# EAGLE design openinstrument (EAGLE 6.5.0)
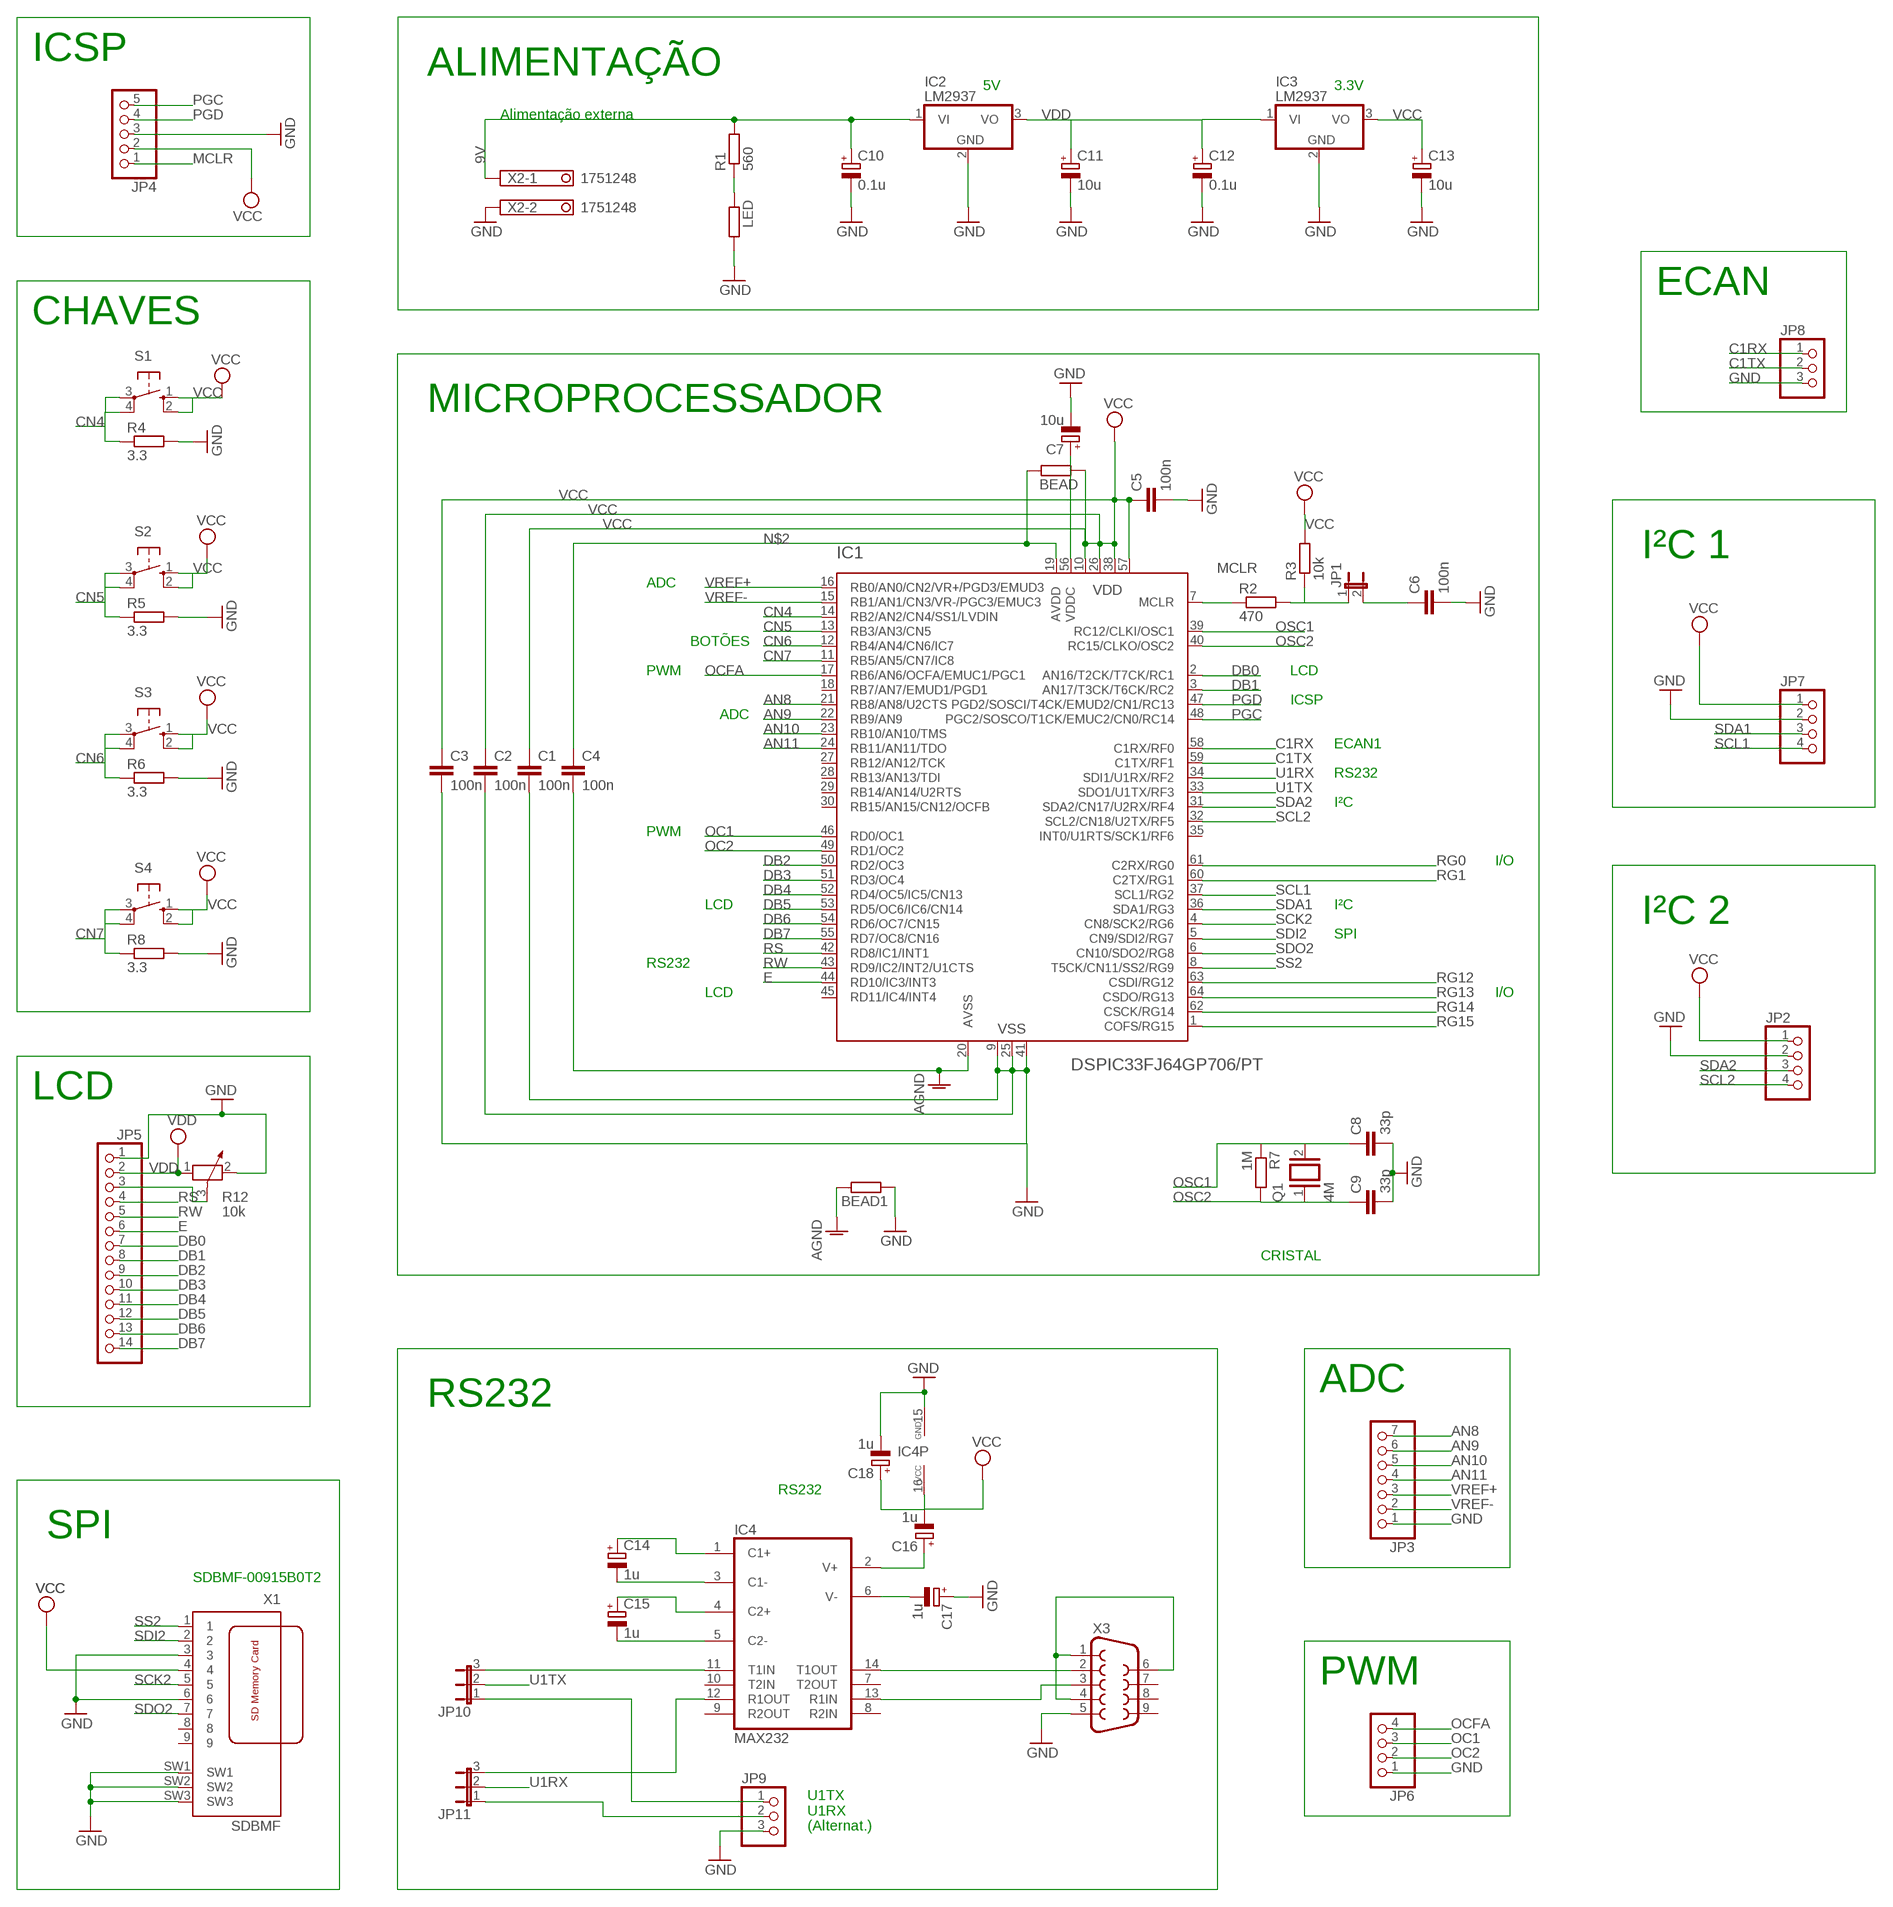
[diagram p0: schematic, sheet 1]

## Parts
BEAD  R-EU_R0805  [R0805]
BEAD1  R-EU_R0805  [R0805]
C1  100n  C-EUC0805  [C0805]
C2  100n  C-EUC0805  [C0805]
C3  100n  C-EUC0805  [C0805]
C4  100n  C-EUC0805  [C0805]
C5  100n  C-EUC0805  [C0805]
C6  100n  C-EUC0805  [C0805]
C7  10u  CPOL-EUE2.5-5  [E2,5-5]
C8  33p  C-EUC0805  [C0805]
C9  33p  C-EUC0805  [C0805]
C10  0.1u  CPOL-EUE2.5-5  [E2,5-5]
C11  10u  CPOL-EUE2.5-5  [E2,5-5]
C12  0.1u  CPOL-EUE2.5-5  [E2,5-5]
C13  10u  CPOL-EUE2.5-5  [E2,5-5]
C14  1u  CPOL-EUE2.5-5  [E2,5-5]
C15  1u  CPOL-EUE2.5-5  [E2,5-5]
C16  1u  CPOL-EUE2.5-5  [E2,5-5]
C17  1u  CPOL-EUE2.5-5  [E2,5-5]
C18  1u  CPOL-EUE2.5-5  [E2,5-5]
IC1  DSPIC33FJ64GP706/PT  [TQFP64-10X10]
IC2  LM2937  [TO263-3]
IC3  LM2937  [TO263-3]
IC4  MAX232  [DIL16]
JP1  JP1E  [JP1]
JP2  PINHD-1X4  [1X04]
JP3  PINHD-1X7  [1X07]
JP4  PINHD-1X5  [1X05]
JP5  PINHD-1X14  [1X14]
JP6  PINHD-1X4  [1X04]
JP7  PINHD-1X4  [1X04]
JP8  PINHD-1X3  [1X03]
JP9  PINHD-1X3  [1X03]
JP10  JP2E  [JP2]
JP11  JP2E  [JP2]
LED  R-EU_R0805  [R0805]
Q1  4M  XTAL/S  [QS]
R1  560  R-EU_R0805  [R0805]
R2  470  R-EU_R0805  [R0805]
R3  10k  R-EU_R0805  [R0805]
R4  3.3  R-EU_R0805  [R0805]
R5  3.3  R-EU_R0805  [R0805]
R6  3.3  R-EU_R0805  [R0805]
R7  1M  R-EU_R0805  [R0805]
R8  3.3  R-EU_R0805  [R0805]
R12  10k  POTENTIOMETER_PT-10S  [PT-10S]
S1  10-XX  [B3F-10XX]
S2  10-XX  [B3F-10XX]
S3  10-XX  [B3F-10XX]
S4  10-XX  [B3F-10XX]
X1  SDBMF  [SDBMF-009XXBXX2]
X2  1751248  [1751248]
X3  F09H  [F09H]

## Nets
9V: C10.+ IC2.1(VI) R1.2 X2.1
AGND: BEAD1.2 C4.2 IC1.20(AVSS)
AN8: IC1.21(RB8/AN8/U2CTS) JP3.7
AN9: IC1.22(RB9/AN9) JP3.6
AN10: IC1.23(RB10/AN10/TMS) JP3.5
AN11: IC1.24(RB11/AN11/TDO) JP3.4
C1RX: IC1.58(C1RX/RF0) JP8.1
C1TX: IC1.59(C1TX/RF1) JP8.2
CN4: IC1.14(RB2/AN2/CN4/SS1/LVDIN) R4.1 S1.3(P) S1.4(P1)
CN5: IC1.13(RB3/AN3/CN5) R5.1 S2.3(P) S2.4(P1)
CN6: IC1.12(RB4/AN4/CN6/IC7) R6.1 S3.3(P) S3.4(P1)
CN7: IC1.11(RB5/AN5/CN7/IC8) R8.1 S4.3(P) S4.4(P1)
DB0: IC1.2(AN16/T2CK/T7CK/RC1) JP5.7
DB1: IC1.3(AN17/T3CK/T6CK/RC2) JP5.8
DB2: IC1.50(RD2/OC3) JP5.9
DB3: IC1.51(RD3/OC4) JP5.10
DB4: IC1.52(RD4/OC5/IC5/CN13) JP5.11
DB5: IC1.53(RD5/OC6/IC6/CN14) JP5.12
DB6: IC1.54(RD6/OC7/CN15) JP5.13
DB7: IC1.55(RD7/OC8/CN16) JP5.14
E: IC1.44(RD10/IC3/INT3) JP5.6
GND: BEAD1.1 C1.2 C2.2 C3.2 C5.2 C6.2 C7.- C8.2 C9.2 C10.- C11.- C12.- C13.- C17.+ C18.- IC1.9(VSS) IC1.25(VSS) IC1.41(VSS) IC2.2(GND) IC3.2(GND) IC4.15(GND) JP2.2 JP3.1 JP4.3 JP5.1 JP6.1 JP7.2 JP8.3 JP9.3 LED.2 R4.2 R5.2 R6.2 R8.2 R12.2 X1.3 X1.6 X1.SW1 X1.SW2 X1.SW3 X2.2 X3.5
MCLR: JP4.1 R2.1
N$1: JP5.3 R12.3
N$2: BEAD.2 C4.1 IC1.19(AVDD)
N$3: JP1.1 R2.2 R3.1
N$4: C6.1 JP1.2
N$6: IC4.14(T1OUT) X3.2
N$7: C14.- IC4.3(C1-)
N$8: C14.+ IC4.1(C1+)
N$9: C15.- IC4.5(C2-)
N$10: C7.+ IC1.56(VDDC)
N$11: LED.1 R1.1
N$12: C15.+ IC4.4(C2+)
N$13: C16.+ IC4.2(V+)
N$14: C17.- IC4.6(V-)
N$15: IC4.13(R1IN) X3.3
N$16: X3.1 X3.4 X3.6
N$17: IC4.12(R1OUT) JP11.3
N$18: JP9.1 JP10.1
N$19: IC4.11(T1IN) JP10.3
N$21: JP9.2 JP11.1
OC1: IC1.46(RD0/OC1) JP6.3
OC2: IC1.49(RD1/OC2) JP6.2
OCFA: IC1.17(RB6/AN6/OCFA/EMUC1/PGC1) JP6.4
OSC1: C8.1 IC1.39(RC12/CLKI/OSC1) Q1.2 R7.1
OSC2: C9.1 IC1.40(RC15/CLKO/OSC2) Q1.1 R7.2
PGC: IC1.48(PGC2/SOSCO/T1CK/EMUC2/CN0/RC14) JP4.5
PGD: IC1.47(PGD2/SOSCI/T4CK/EMUD2/CN1/RC13) JP4.4
RG0: IC1.61(C2RX/RG0)
RG1: IC1.60(C2TX/RG1)
RG12: IC1.63(CSDI/RG12)
RG13: IC1.64(CSDO/RG13)
RG14: IC1.62(CSCK/RG14)
RG15: IC1.1(COFS/RG15)
RS: IC1.42(RD8/IC1/INT1) JP5.4
RW: IC1.43(RD9/IC2/INT2/U1CTS) JP5.5
SCK2: IC1.4(CN8/SCK2/RG6) X1.5
SCL1: IC1.37(SCL1/RG2) JP7.4
SCL2: IC1.32(SCL2/CN18/U2TX/RF5) JP2.4
SDA1: IC1.36(SDA1/RG3) JP7.3
SDA2: IC1.31(SDA2/CN17/U2RX/RF4) JP2.3
SDI2: IC1.5(CN9/SDI2/RG7) X1.2
SDO2: IC1.6(CN10/SDO2/RG8) X1.7
SS2: IC1.8(T5CK/CN11/SS2/RG9) X1.1
U1RX: IC1.34(SDI1/U1RX/RF2) JP11.2
U1TX: IC1.33(SDO1/U1TX/RF3) JP10.2
VCC: BEAD.1 C1.1 C2.1 C3.1 C5.1 C13.+ C16.- C18.+ IC1.10(VDD) IC1.26(VDD) IC1.38(VDD) IC1.57(VDD) IC3.3(VO) IC4.16(VCC) JP2.1 JP4.2 JP7.1 R3.2 S1.1(S) S1.2(S1) S2.1(S) S2.2(S1) S3.1(S) S3.2(S1) S4.1(S) S4.2(S1) X1.4
VDD: C11.+ C12.+ IC2.3(VO) IC3.1(VI) JP5.2 R12.1
VREF+: IC1.16(RB0/AN0/CN2/VR+/PGD3/EMUD3) JP3.3
VREF-: IC1.15(RB1/AN1/CN3/VR-/PGC3/EMUC3) JP3.2
Unconnected: IC1.7(MCLR) IC1.18(RB7/AN7/EMUD1/PGD1) IC1.27(RB12/AN12/TCK) IC1.28(RB13/AN13/TDI) IC1.29(RB14/AN14/U2RTS) IC1.30(RB15/AN15/CN12/OCFB) IC1.35(INT0/U1RTS/SCK1/RF6) IC1.45(RD11/IC4/INT4) IC4.7(T2OUT) IC4.8(R2IN) IC4.9(R2OUT) IC4.10(T2IN) X1.8 X1.9 X3.7 X3.8 X3.9

## Notes on the sheet
- ICSP
- ALIMENTAÇÃO
- 5V | 3.3V
- Alimentação externa
- ECAN
- CHAVES
- MICROPROCESSADOR
- I²C 1
- ADC
- BOTÕES
- PWM | LCD
- ICSP
- ADC
- ECAN1
- RS232
- I²C
- PWM
- I/O
- LCD | I²C
- I²C 2
- SPI
- RS232
- LCD | I/O
- LCD
- CRISTAL
- RS232
- ADC
- RS232
- SPI
- SDBMF-00915B0T2
- PWM
- U1TX
  U1RX
  (Alternat.)

## Library data of the parts
BEAD BEAD1 LED R1-R8 = rcl:R-EU_: RESISTOR, European symbol
C1-C6 C8 C9 = rcl:C-EU: CAPACITOR, European symbol
C7 C10-C18 = rcl:CPOL-EU: POLARIZED CAPACITOR, European symbol
IC1 = microchip-dspic:DSPIC33FJ64GP706: dsPIC33 General DSC with CAN and CoDec ports
IC2 IC3 = linear:LM2937: LM2937-2.5, LM2937-3.3 400mA and 500mA Voltage Regulators Source: http://cache.national.com/ds/LM/LM2937-2.5.pdf
IC4 = maxim:MAX232: RS232 TRANSCEIVER; MF: MAXIM; MPN: MAX232ACPE+; OC_FARNELL: 9723773; OC_NEWARK: 68K4544
JP1 = jumper:JP1E: JUMPER
JP2 JP6 JP7 = pinhead:PINHD-1X4: PIN HEADER
JP3 = pinhead:PINHD-1X7: PIN HEADER
JP4 = pinhead:PINHD-1X5: PIN HEADER
JP5 = pinhead:PINHD-1X14: PIN HEADER
JP8 JP9 = pinhead:PINHD-1X3: PIN HEADER
JP10 JP11 = jumper:JP2E: JUMPER
Q1 = special:XTAL/S: CRYSTAL
R12 = rcl:POTENTIOMETER_: Potentiometer
S1-S4 = switch-omron:10-XX: OMRON SWITCH; MPN: B3F-1000; OC_FARNELL: 176432; OC_NEWARK: 36M3542
X1 = farnell:SDBMF: SD MEMORY CARD PUSH-PUSH WITH CONNECTOR TYPE B (BIG SWUÌTCH #3) KINGFONT PRECISION INDUSTIAL CO., LTD Source: http://www.farnell.com/datasheets/74273.pdf Best.-Nr.: 9186174 Hersteller: MULTICOMP Herstellerbez.: SDBMF-00915B0T2
X2 = con-phoenix-350:1751248: MKDS 1/ 2-3,5 Printklemme Nennstrom: 10 A Bemessungsspannung: 160 V Raster: 3,5 mm Polzahl: 2 Montageart: Löten Anschlussart: Schraubanschluss Anschlussrichtung vom Leiter zur Platine: 0° Source: http://eshop.phoenixcontact.com .. 1751248.pdf; OC_FARNELL: unknown; OC_NEWARK: unknown
X3 = con-subd:F09: SUB-D; OC_FARNELL: unknown; OC_NEWARK: unknown

## Board
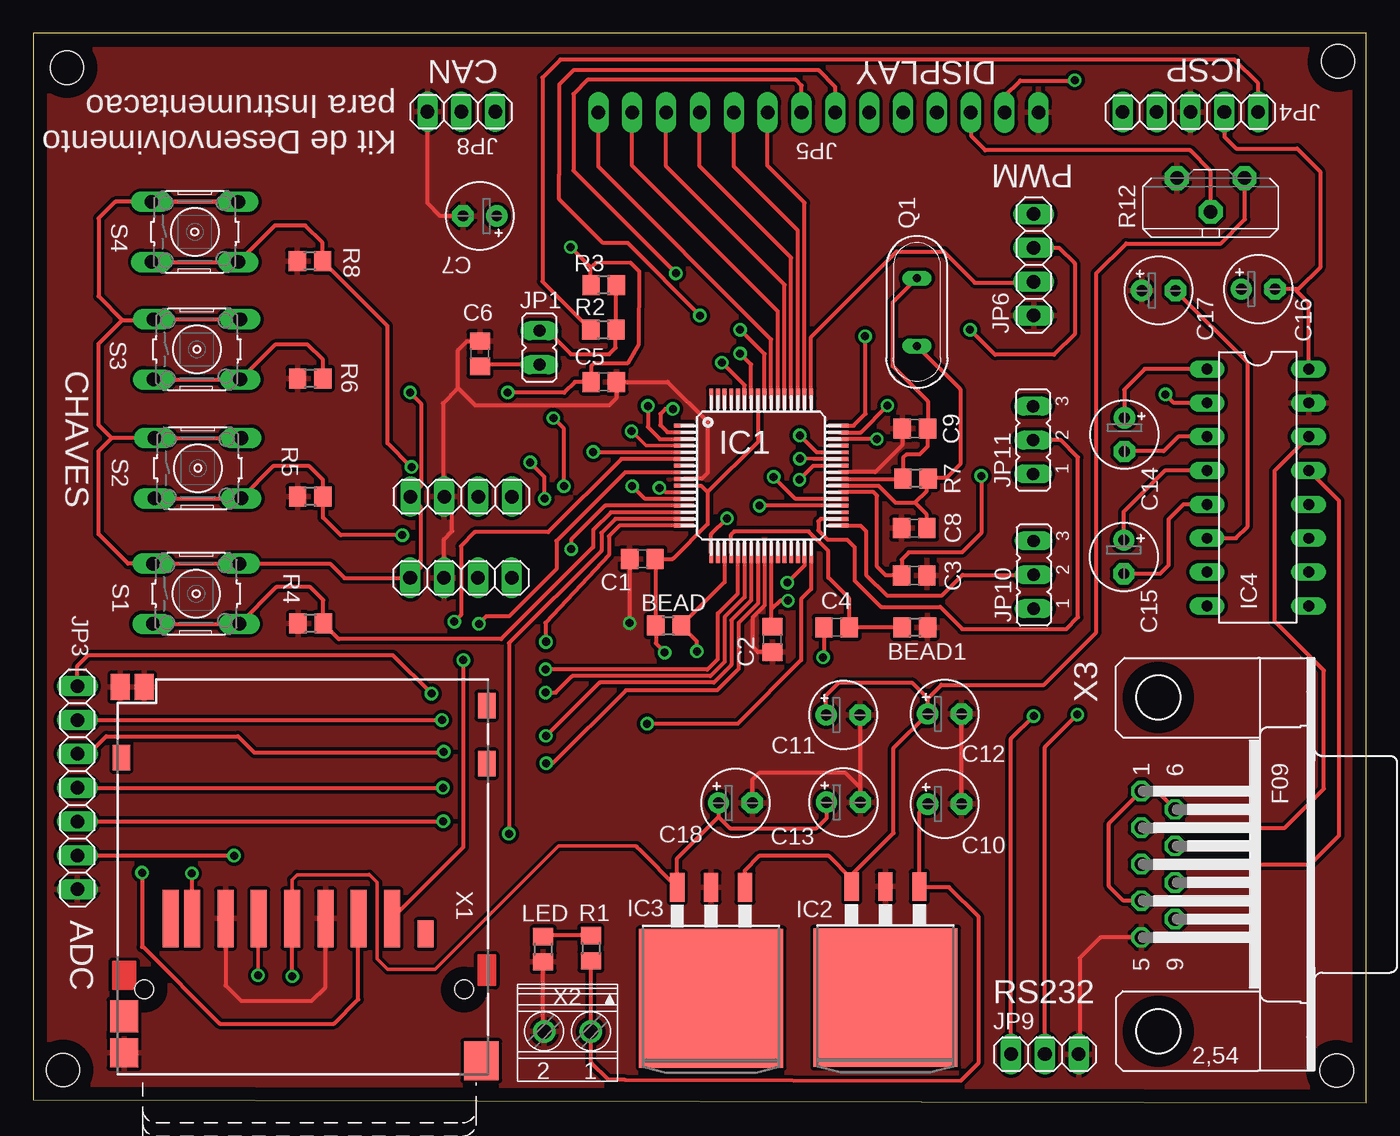
[diagram p1: board, top side]
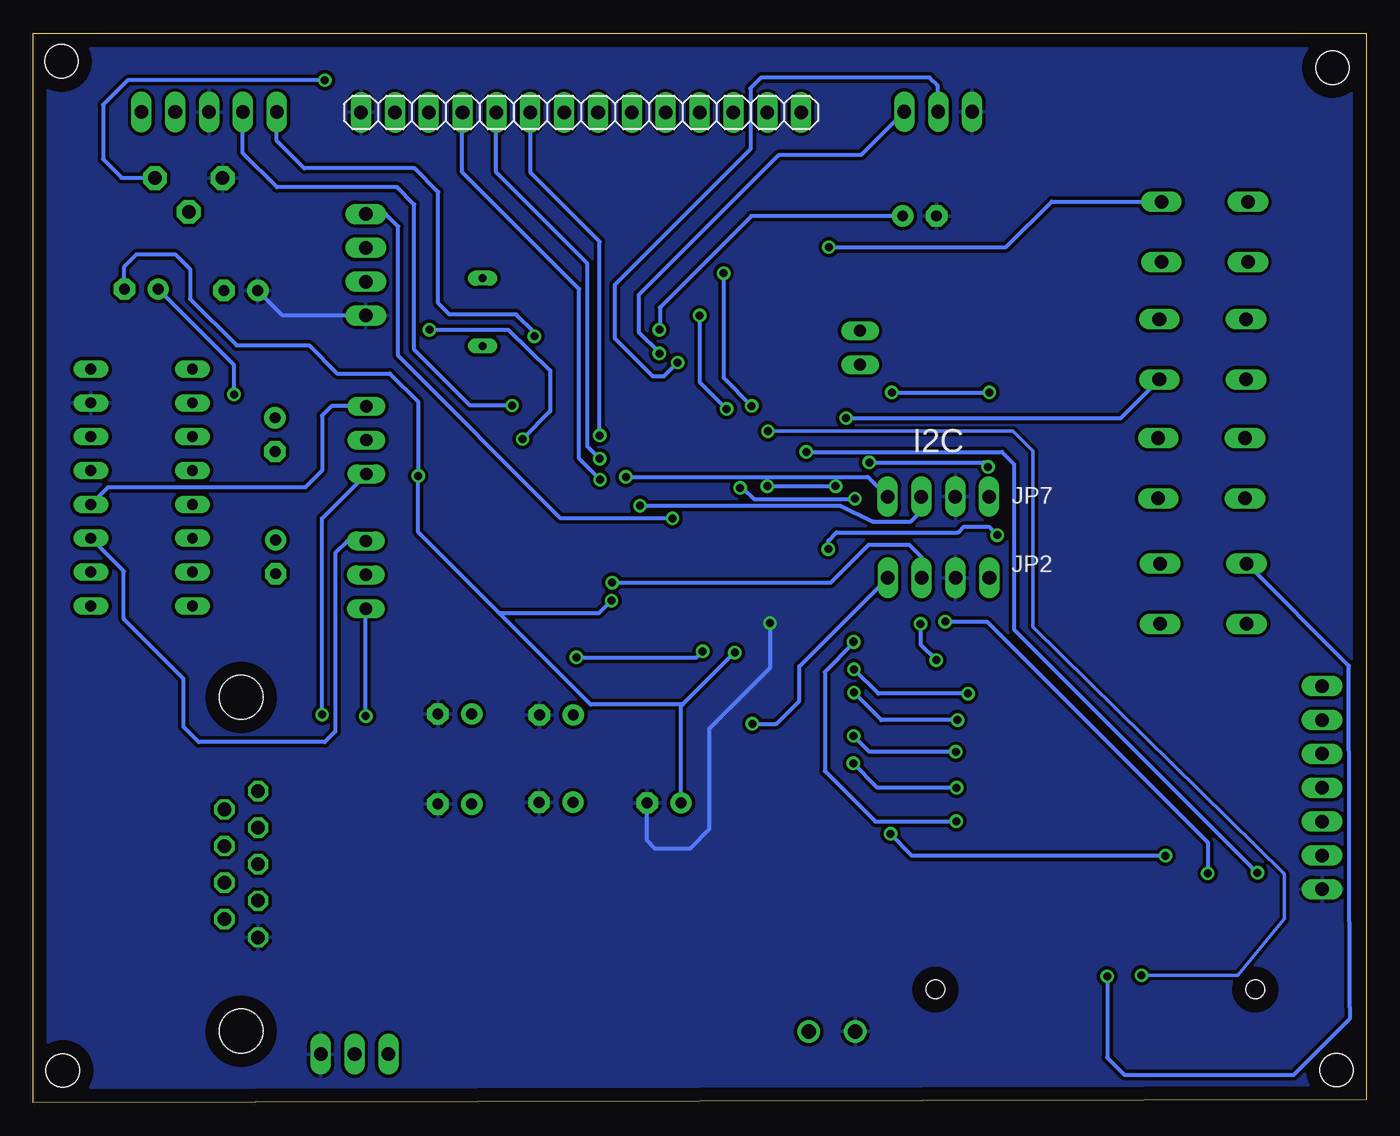
[diagram p2: board, bottom side, seen from below]

Size 100 x 80.23 mm. Coordinates in mm from the lower left corner, seen from the top.
Outline: 0,0.23 100,0 100,80.23 0,80.23 0,0.23
Copper layers (1*16): Top 0.035mm / dielectric 1.5mm / Bottom 0.035mm
Design rules "default *": minimum track width 10mil, minimum drill 24mil, track to track 10mil, track to pad 10mil, pad to pad 10mil, via to via 10mil, smd to smd 10mil, copper to edge 40mil, drill to drill 8mil, minimum pad ring 10mil, minimum via ring 8mil, stop-mask expansion 4mil, vias tented up to drill 0mil, thermal gap 10mil
Holes 2.5 mm at 2.51,77.65 97.89,78.13 97.79,2.41 2.24,2.44

### Footprints (pad centres in the part's own frame; a part is rotated, then mirrored left to right if it is on the bottom)
R0805 = smd 1.3 x 1.5: 1 -0.95,0; 2 0.95,0
C0805 = smd 1.3 x 1.5: 1 -0.95,0; 2 0.95,0
E2,5-5 = drill 0.813 pad 1.6: + -1.27,0 | drill 0.813 pad 1.6 octagon: - 1.27,0
TQFP64-10X10 = smd 1.5 x 0.28: 1 -5.8,3.75; 2 -5.8,3.25; 3 -5.8,2.75; 4 -5.8,2.25; 5 -5.8,1.75; 6 -5.8,1.25; 7 -5.8,0.75; 8 -5.8,0.25; 9 -5.8,-0.25; 10 -5.8,-0.75; 11 -5.8,-1.25; 12 -5.8,-1.75; 13 -5.8,-2.25; 14 -5.8,-2.75; 15 -5.8,-3.25; 16 -5.8,-3.75; 33 5.8,-3.75; 34 5.8,-3.25; 35 5.8,-2.75; 36 5.8,-2.25; 37 5.8,-1.75; 38 5.8,-1.25; 39 5.8,-0.75; 40 5.8,-0.25; 41 5.8,0.25; 42 5.8,0.75; 43 5.8,1.25; 44 5.8,1.75; 45 5.8,2.25; 46 5.8,2.75; 47 5.8,3.25; 48 5.8,3.75 | smd 0.28 x 1.5: 17 -3.75,-5.8; 18 -3.25,-5.8; 19 -2.75,-5.8; 20 -2.25,-5.8; 21 -1.75,-5.8; 22 -1.25,-5.8; 23 -0.75,-5.8; 24 -0.25,-5.8; 25 0.25,-5.8; 26 0.75,-5.8; 27 1.25,-5.8; 28 1.75,-5.8; 29 2.25,-5.8; 30 2.75,-5.8; 31 3.25,-5.8; 32 3.75,-5.8; 49 3.75,5.8; 50 3.25,5.8; 51 2.75,5.8; 52 2.25,5.8; 53 1.75,5.8; 54 1.25,5.8; 55 0.75,5.8; 56 0.25,5.8; 57 -0.25,5.8; 58 -0.75,5.8; 59 -1.25,5.8; 60 -1.75,5.8; 61 -2.25,5.8; 62 -2.75,5.8; 63 -3.25,5.8; 64 -3.75,5.8
TO263-3 = smd 1.067 x 2.159: 1 -2.54,-5.791; 2 0,-5.791; 3 2.54,-5.791 | smd 10.8 x 10.41: TAB 0,2.54
DIL16 = drill 0.813 long: 1 -8.89,-3.81; 2 -6.35,-3.81; 3 -3.81,-3.81; 4 -1.27,-3.81; 5 1.27,-3.81; 6 3.81,-3.81; 7 6.35,-3.81; 8 8.89,-3.81; 9 8.89,3.81; 10 6.35,3.81; 11 3.81,3.81; 12 1.27,3.81; 13 -1.27,3.81; 14 -3.81,3.81; 15 -6.35,3.81; 16 -8.89,3.81
JP1 = drill 0.914 long: 1 0,-1.27; 2 0,1.27
1X04 = drill 1.016 long: 1 -3.81,0; 2 -1.27,0; 3 1.27,0; 4 3.81,0
1X07 = drill 1.016 long: 1 -7.62,0; 2 -5.08,0; 3 -2.54,0; 4 0,0; 5 2.54,0; 6 5.08,0; 7 7.62,0
1X05 = drill 1.016 long: 1 -5.08,0; 2 -2.54,0; 3 0,0; 4 2.54,0; 5 5.08,0
1X14 = drill 1.016 long: 1 -16.51,0; 2 -13.97,0; 3 -11.43,0; 4 -8.89,0; 5 -6.35,0; 6 -3.81,0; 7 -1.27,0; 8 1.27,0; 9 3.81,0; 10 6.35,0; 11 8.89,0; 12 11.43,0; 13 13.97,0; 14 16.51,0
1X03 = drill 1.016 long: 1 -2.54,0; 2 0,0; 3 2.54,0
JP2 = drill 0.914 long: 1 -2.54,0; 2 0,0; 3 2.54,0
QS = drill 0.61 long: 1 -2.54,0; 2 2.54,0
PT-10S = drill 1.016 pad 1.778 octagon: 1 -2.54,-1.27; 2 2.54,-1.27; 3 0,1.27
B3F-10XX = drill 1.016 long: 1 -3.251,2.261; 2 3.251,2.261; 3 -3.251,-2.261; 4 3.251,-2.261
SDBMF-009XXBXX2 = smd 1.2 x 4.3: 1 6.7,5.325; 2 4.2,5.325; 3 1.7,5.325; 4 -0.8,5.325; 5 -3.3,5.325; 6 -5.8,5.325; 7 -8.3,5.325; 8 -9.925,5.325 | smd 1.2 x 2: 9 9.2,4.175 | smd 2.1 x 2.4: M1 -13.4,-2 | smd 2.6 x 2.9: M2 13.4,-5.35 | smd 1.3 x 1.9: M3 -13.6,17.4; M4 13.8,16.95; M5 13.8,21.3 | smd 1.4 x 1.95: SW1 -11.9,22.7; SW3 -13.7,22.7 | smd 2.1 x 2.2: SW2 -13.4,-4.75 | hole 1.4: -11.9,0; 12.1,0
1751248 = drill 1.1 pad 1.7: 1 -1.75,-0.1; 2 1.75,-0.1
F09H = drill 1.016 octagon: 1 -5.486,-1.27; 2 -2.743,-1.27; 3 0,-1.27; 4 2.743,-1.27; 5 5.486,-1.27; 6 -4.115,1.27; 7 -1.372,1.27; 8 1.372,1.27; 9 4.115,1.27 | hole 3.302: -12.522,0; 12.522,0

### Placement (x,y rotation side)
BEAD  47.65,35.79 0 top
BEAD1  66.14,35.66 180 top
C1  45.69,40.79 180 top
C2  55.45,34.75 270 top
C3  66.09,39.55 0 top
C4  60.27,35.66 0 top
C5  42.8,54.08 0 top
C6  33.5,56.18 90 top
C7  33.5,66.52 180 top
C8  66.09,43.1 180 top
C9  66.14,50.57 180 top
C10  68.38,22.4 0 top
C11  60.76,29.08 0 top
C12  68.38,29.16 0 top
C13  60.78,22.53 0 top
C14  81.86,50.11 270 top
C15  81.81,40.94 270 top
C16  91.9,61.04 0 top
C17  84.43,60.93 0 top
C18  52.68,22.48 0 top
IC1  54.61,47.04 0 top
IC2  63.93,10.41 180 top
IC3  50.85,10.36 180 top
IC4  91.87,46.15 270 top
JP1  37.97,56.64 180 top
JP2  32.08,39.37 0 top
JP3  3.3,23.62 90 top
JP4  86.82,74.32 180 top
JP5  58.9,74.3 0 bottom
JP6  75.06,62.87 90 top
JP7  32.11,45.47 0 top
JP8  32.11,74.35 180 top
JP9  75.9,3.63 0 top
JP10  75.06,39.6 90 top
JP11  75.01,49.71 90 top
LED  38.25,11.51 270 top
Q1  66.29,59.31 270 top
R1  41.83,11.58 270 top
R2  42.77,57.99 0 top
R3  42.8,61.34 180 top
R4  20.8,35.94 180 top
R5  20.78,45.47 180 top
R6  20.78,54.33 180 top
R7  66.19,46.84 180 top
R8  20.75,63.14 180 top
R12  88.34,68.1 180 top
S1  12.22,38.18 0 top
S2  12.34,47.6 0 top
S3  12.27,56.52 0 top
S4  12.12,65.33 0 top
X1  20.22,8.48 0 top
X2  40.08,5.23 180 top
X3  84.4,17.88 270 top

### Tracks (layer width: path | path; a pad name or v marks a point on that pad's centre or on a via)
9V
  Top 0.305: C10.+ 66.47,21.77 IC2.1 66.52,16.15 68.71,16.15 70.94,13.92 70.94,3 69.6,1.65 44.4,1.7 43.16,1.7 41.86,3 41.83,3 X2.1 R1.2
AGND
  Top 0.305: BEAD1.2 C4.2 61.22,37.81 59.64,39.4 59.64,41.38 58.17,42.85 52.6,42.85 52.36,42.61 IC1.20
AN8  (via drill 0.6)
  Top 0.305: IC1.21 52.86,38.2 51.36,36.7 51.36,33.27 50.57,32.49 38.46,32.49 v38.43,32.51 | JP3.7 3.3,32.77 4.12,33.58 26.98,33.58 v29.87,30.68
  Bottom 0.305: v29.87,30.68 36.6,30.68 v38.43,32.51
AN9  (via drill 0.6)
  Top 0.305: IC1.22 53.36,37.92 51.87,36.42 51.87,33.07 50.8,32 40.44,32 39.19,30.76 v38.43,30.76 | JP3.6 v30.66,28.7
  Bottom 0.305: v30.66,28.7 36.37,28.7 v38.43,30.76
AN10  (via drill 0.6)
  Top 0.305: IC1.23 53.86,37.68 52.38,36.19 52.38,32.84 51.05,31.52 42.49,31.52 40.31,29.36 v38.46,27.51 | JP3.5 4.17,26.16 5.49,27.48 15.37,27.48 16.59,26.26 30.73,26.26 v30.79,26.31
  Bottom 0.305: v38.46,27.51 37.26,26.31 37.08,26.31 v30.79,26.31
AN11  (via drill 0.6)
  Top 0.305: IC1.24 54.36,37.44 52.91,35.99 52.91,32.54 51.31,30.94 44.45,30.94 38.96,25.45 v38.48,25.45 | JP3.4 v30.73,23.62
  Bottom 0.305: v30.73,23.62 36.65,23.62 v38.48,25.45
C1RX  (via drill 0.6)
  Top 0.305: IC1.58 53.86,55.39 v53.03,56.21
  Bottom 0.305: v53.03,56.21 53.03,56.26 54.56,57.78 54.56,60.6 44.04,71.12 37.87,71.12 JP8.1
C1TX  (via drill 0.6)
  Top 0.305: IC1.59 53.36,53.83 v51.66,55.52
  Bottom 0.305: v51.66,55.52 52.7,54.48 53.52,54.48 56.36,57.33 56.36,61.37 46.22,71.51 46.2,71.53 46.2,76.1 45.39,76.91 32.77,76.91 32.18,76.33 32.18,74.42 JP8.2
CN4
  Top 0.305: S1.3 S1.4 18.24,38.68 20.78,38.68 21.75,37.71 R4.1 22.92,34.77 35.1,34.77 42.01,41.68 42.01,42.98 43.33,44.29 IC1.14
CN5  (via drill 0.6)
  Top 0.305: S2.3 S2.4 18.01,47.75 20.7,47.75 21.73,46.73 R5.1 21.74,45.45 21.74,43.89 23.06,42.57 v27.69,42.57 | IC1.13 42.91,44.79 40.36,42.24 v40.36,41.53
  Bottom 0.305: v40.36,41.53 40.36,42.14 39.73,42.77 30.61,42.77 30.18,43.21 28.32,43.21 v27.69,42.57
CN6  (via drill 0.6)
  Top 0.305: S3.3 S3.4 18.14,56.87 20.6,56.87 21.73,55.74 R6.1 | IC1.12 45.9,45.29 v44.93,46.25 | v39.8,46.25 39.8,50.57 v39.01,51.36
  Bottom 0.305: v44.93,46.25 v39.8,46.25 | v39.01,51.36 18.41,51.36 S3.4
CN7  (via drill 0.6)
  Top 0.305: S4.3 S4.4 18.11,65.81 20.4,65.81 21.7,64.51 R8.1 26.57,58.28 26.57,49.48 28.35,47.7 v28.37,47.7 | IC1.11 47.45,45.79 v46.97,46.13 | v38.35,45.31 38.35,46.94 v37.29,48.03
  Bottom 0.305: v46.97,46.13 46.79,46.13 45.95,45.29 38.38,45.29 v38.35,45.31 | v37.29,48.03 28.7,48.03 v28.37,47.7
DB0  (via drill 0.6)
  Top 0.305: JP5.7 60.17,76.2 58.93,77.44 40.51,77.44 39.45,76.38 39.45,69.65 39.45,67.79 42.75,64.49 44.6,64.49 v50.01,59.05 | v47.98,52.04 47.42,52.04 47.04,51.66 47.04,50.83 47.57,50.29 IC1.2
  Bottom 0.305: v50.01,59.05 50.01,54.08 v47.98,52.04
DB1  (via drill 0.6)
  Top 0.305: JP5.8 57.63,76.3 57.2,76.73 41.58,76.73 40.51,75.67 40.51,69.93 v48.21,62.23 | v46.1,52.27 46.1,50.7 47.02,49.78 IC1.3
  Bottom 0.305: v48.21,62.23 48.21,54.38 v46.1,52.27
DB2
  Top 0.305: IC1.50 57.86,67.51 55.07,70.31 55.07,74.27 JP5.9
DB3
  Top 0.305: IC1.51 57.36,65.42 52.55,70.23 JP5.10
DB4
  Top 0.305: IC1.52 56.86,63.38 49.99,70.26 49.99,74.27 JP5.11
DB5
  Top 0.305: IC1.53 56.36,61.37 47.47,70.26 JP5.12
DB6
  Top 0.305: IC1.54 55.86,59.35 44.93,70.28 JP5.13
DB7
  Top 0.305: IC1.55 55.36,57.26 42.39,70.23 JP5.14
E  (via drill 0.6)
  Top 0.305: IC1.44 58.78,48.79 v57.51,50.06
  Bottom 0.305: v57.51,50.06 57.51,64.59 62.69,69.77 62.69,74.27 JP5.6
GND  (via drill 0.6)
  Top 0.305: C9.2 65.19,49.32 63.17,47.29 IC1.41 | IC1.9 48.83,46.81 50.16,46.81 50.6,47.24 50.6,51.08 47.6,54.08 C5.2 43.75,52.84 43.2,52.3 33.17,52.3 31.88,53.59 | 31.88,53.59 31.88,56.46 32.54,57.12 33.49,57.12 C6.2 | 31.88,53.59 30.73,52.45 30.73,45.57 JP7.2 | 30.81,45.44 JP7.2 | C2.2 54.37,33.8 53.98,34.19 53.98,36.42 54.86,37.31 IC1.25 | C10.- C12.- | C13.- 62.05,23.6 | 62.05,23.6 62.05,29.06 C11.- | C18.- 53.95,24.23 54.48,24.76 60.88,24.76 62.05,23.6 | C7.- 30.53,66.52 29.57,67.49 JP8.3 | JP2.2 30.81,42.27 31.42,42.88 31.42,44.88 JP7.2 | C1.2 44.74,35.98 v44.73,35.97 | X3.5 80.06,12.4 78.51,10.85 78.51,3.71 JP9.3 | 38.25,5.33 LED.2 | X1.6 14.42,8.8 15.6,7.62 20.88,7.62 21.92,8.66 X1.3
  Top 0.406: X2.2 38.25,5.33
  Bottom 0.305: JP6.1 81.28,59.05 C17.+ | v44.73,35.97 44.73,32.61 49.3,28.04 49.3,20.5 50.75,19.05 53.34,19.05 53.95,19.66 C18.-
  pour Top: 0.43,1.85 1.75,0.53 97.51,0.53 99.21,2.24 99.21,76.63 96.6,79.25 1.93,79.25 0.46,77.77
  pour Bottom: 96.9,79.81 1.55,79.81 0.3,78.56 0.3,2.06 1.93,0.43 98.17,0.43 99.69,1.96 99.52,77.19
MCLR
  Top 0.305: R2.1 38.2,61.61 38.2,76.91 39.55,78.26 90.12,78.26 91.9,76.48 JP4.1
N$1
  Top 0.305: R12.3 88.34,69.9 86.79,71.45 71.42,71.45 70.38,72.49 70.38,74.24 JP5.3
N$2  (via drill 0.6)
  Top 0.305: IC1.19 51.86,39.05 BEAD.2 49.78,34.6 v49.78,33.86 | C4.1 59.32,33.47 v59.26,33.4
  Bottom 0.305: v59.26,33.4 50.24,33.4 v49.78,33.86
N$3
  Top 0.305: R3.1 43.72,61.32 R2.2 43.69,57.95 43.69,56.64 43.2,56.16 40.34,56.16 38.58,57.91 JP1.1
N$4
  Top 0.305: JP1.2 33.64,55.37 C6.1
N$6
  Top 0.305: IC4.14 93.14,47.42 93.14,36.09 96.83,32.41 96.83,23.55 93.9,20.62 X3.2
N$7
  Top 0.305: IC4.3 85.9,49.96 84.81,48.87 81.89,48.87 C14.-
N$8
  Top 0.305: IC4.1 83.39,55.04 81.84,53.49 81.84,51.41 C14.+
N$9
  Top 0.305: IC4.5 86.28,44.88 85.17,43.76 85.17,40.31 84.53,39.67 C15.-
N$10  (via drill 0.6)
  Top 0.305: v53.03,57.99 54.86,56.16 IC1.56
  Bottom 0.305: C7.+ 46.13,66.52 52.98,59.66 52.98,58.04 v53.03,57.99
N$11
  Top 0.305: R1.1 38.25,12.53
  Top 0.406: 38.25,12.53 LED.1
N$12
  Top 0.305: IC4.4 84.89,47.42 81.79,44.32 81.79,42.24 C15.+
N$13  (via drill 0.6)
  Top 0.305: IC4.2 85.57,52.5 v84.94,53.14
  Bottom 0.305: v84.94,53.14 84.94,55.35 C16.+
N$14
  Top 0.305: IC4.6 90.22,42.34 91.11,43.23 91.11,55.52 C17.-
N$15
  Top 0.305: X3.3 95.81,17.88 97.97,20.04 97.97,45.14 IC4.13
N$16
  Top 0.305: X3.6 84.3,23.37 X3.1 80.7,20.93 80.7,16.23 81.79,15.14 X3.4
N$17
  Bottom 0.305: JP11.3 77.62,52.25 78.33,51.54 78.33,47.42 79.6,46.15 94.41,46.15 IC4.12
N$18  (via drill 0.6)
  Top 0.305: JP9.1 73.36,27.3 v75.06,29.01
  Bottom 0.305: v75.06,29.01 JP10.1
N$19
  Bottom 0.305: JP10.3 76.43,42.14 77.34,41.22 77.34,27.84 78.13,27.05 87.58,27.05 88.72,28.19 88.72,31.8 93.22,36.3 93.22,39.88 IC4.11
N$21  (via drill 0.6)
  Top 0.305: JP9.2 75.89,26.67 v78.33,29.11
  Bottom 0.305: v78.33,29.11 78.33,43.84 JP11.1
OC1  (via drill 0.6)
  Top 0.305: JP6.3 76.96,64.13 78.13,62.97 78.13,57.66 76.58,56.11 72.16,56.11 v70.28,57.99 | v63.3,49.78 IC1.46
  Bottom 0.305: v70.28,57.99 64.36,57.99 61.21,54.94 61.21,51.87 v63.3,49.78
OC2
  Top 0.305: IC1.49 58.36,57.45 64.77,63.86 68.3,63.86 70.64,61.52 74.98,61.52 JP6.2
OCFA  (via drill 0.6)
  Top 0.305: IC1.17 50.86,42.66 v52.05,43.84
  Bottom 0.305: v52.05,43.84 60.43,43.84 72.62,56.03 72.62,65.74 73.56,66.67 JP6.4
OSC1
  Top 0.305: IC1.39 63.41,46.29 64.69,45.01 66.15,45.01 | 66.15,45.01 67.04,45.9 67.04,46.74 R7.1 67.17,46.86 68.5,46.86 69.55,47.9 69.55,53.52 Q1.2 | C8.1 67.04,44.12 66.15,45.01
OSC2
  Top 0.305: IC1.40 65.2,46.79 R7.2 65.25,46.85 65.25,48.39 65.51,48.64 66.5,48.64 67.09,49.24 C9.1 67.11,50.59 67.11,52.63 64.49,55.24 64.49,60.05 Q1.1
PGC  (via drill 0.6)
  Top 0.305: IC1.48 61.53,50.79 62.43,51.69 62.43,57.48 v62.41,57.51
  Bottom 0.305: v62.41,57.51 62.41,57.76 63.78,59.13 68.78,59.13 69.62,59.97 69.62,68.33 71.4,70.1 79.68,70.1 81.74,72.16 JP4.5
PGD  (via drill 0.6)
  Top 0.305: IC1.47 62.08,50.29 v64.08,52.3
  Bottom 0.305: v64.08,52.3 67.23,52.3 71.42,56.49 71.42,67.39 72.72,68.68 81.71,68.68 84.28,71.25 JP4.4
RS  (via drill 0.6)
  Top 0.305: v57.48,46.74 58.53,47.79 IC1.42
  Bottom 0.305: JP5.4 67.82,74.27 67.82,69.8 59.05,61.04 59.05,48.31 v57.48,46.74
RW  (via drill 0.6)
  Top 0.305: IC1.43 58.55,48.29 v57.51,48.31
  Bottom 0.305: JP5.5 65.28,74.27 65.28,69.8 58.42,62.94 58.42,49.23 v57.51,48.31
SCK2  (via drill 0.6)
  Top 0.254: IC1.4 45.96,49.29 v44.88,50.37 | v16.87,9.55 16.87,13.76 X1.5
  Bottom 0.254: v44.88,50.37 26.49,50.37 24.99,48.87 24.99,35.69 6.15,17.17 6.15,13.77 9.63,9.55 v16.87,9.55
SCL1  (via drill 0.6)
  Top 0.305: IC1.37 57.2,45.29 v55.55,46.94
  Bottom 0.305: v55.55,46.94 37.39,46.94 JP7.4
SCL2  (via drill 0.6)
  Top 0.305: IC1.32 58.36,38.52 57.61,37.77 57.61,33.2 52.83,28.42 v46.05,28.42
  Bottom 0.305: v46.05,28.42 44.25,28.42 42.52,30.15 42.52,32.74 JP2.4
SDA1  (via drill 0.6)
  Top 0.305: IC1.36 54.5,44.79 v54.48,44.78
  Bottom 0.305: v54.48,44.78 39.5,44.78 37.03,43.61 34.14,43.61 33.4,44.35 33.4,45.44 JP7.3
SDA2  (via drill 0.6)
  Top 0.305: IC1.31 57.86,40.31 v56.57,39.01
  Bottom 0.305: v56.57,39.01 40.16,39.01 37.31,41.86 34.29,41.86 33.35,40.92 JP2.3
SDI2  (via drill 0.6)
  Top 0.305: IC1.5 42.04,48.79 v42.01,48.82 | v8.15,17.25 8.15,11.68 8.23,11.68 13.99,5.92 22.55,5.92 24.38,7.75 24.38,13.77 X1.2 24.41,13.8
  Bottom 0.305: v42.01,48.82 27.33,48.82 26.42,47.9 26.42,35.51 v8.15,17.25
SDO2  (via drill 0.6)
  Top 0.305: IC1.6 44.12,48.29 38.63,42.8 33.12,42.8 32.08,41.76 32.08,36.6 v31.57,36.09 | v11.89,17.2 11.89,13.84 X1.7
  Bottom 0.305: v31.57,36.09 28.47,36.09 11.89,19.51 v11.89,17.2
SS2  (via drill 0.6)
  Top 0.305: IC1.8 44.4,47.29 39.24,42.14 39.24,40.03 35.69,36.47 33.98,36.47 v33.43,35.92 | v32.26,33.2 32.26,19.15 X1.1
  Bottom 0.305: v33.43,35.92 33.43,34.37 v32.26,33.2
U1RX
  Top 0.305: IC1.34 59.08,43.79 58.9,43.61 58.9,42.93 59.59,42.24 61.06,42.24 61.62,41.68 61.62,39.17 63.6,37.19 68.05,37.19 69.7,35.53 77.5,35.53 78.38,36.42 78.38,48.41 77.09,49.71 JP11.2
U1TX
  Top 0.305: IC1.33 62.07,43.29 62.48,42.88 62.48,39.6 64.03,38.05 68.17,38.05 69.72,39.6 JP10.2
VCC  (via drill 0.6)
  Top 0.254: 45.5,18.96 45.21,19.25 39.42,19.25 30.15,9.98 26.59,9.98 25.81,10.77 25.81,16.51 25.2,17.12 25.17,17.09 19.79,17.09 19.79,17.08 19.43,16.73 19.42,16.73 X1.4
  Top 0.305: IC1.38 63.04,45.8 63.3,45.54 63.3,40.21 63.96,39.55 C3.1 65.15,40.74 65.68,41.27 69.67,41.27 71.12,42.72 v71.12,47.02 | IC1.26 55.36,36.98 | 55.36,36.98 55.36,35.66 C2.1 55.35,35.65 | IC1.10 50.1,46.29 50.6,45.8 | 50.6,45.8 50.6,43.41 47.98,40.79 C1.1 46.7,40.74 BEAD.1 46.7,34.45 v47.37,33.76 | 41.81,62.66 42.22,62.99 44.81,63.02 45.47,62.36 45.44,56.9 44.6,55.5 42.11,55.5 41.86,55.24 C5.1 40.64,54.08 39.83,53.26 35.61,53.26 v35.59,53.29 | R3.2 41.81,61.38 41.81,62.69 v40.31,64.19 | S3.2 S3.1 8.97,58.72 6.68,58.72 | S2.2 S2.1 5.89,49.86 | S4.1 S4.2 6.15,67.59 4.9,66.34 4.9,60.5 6.68,58.72 | 5.89,49.86 4.9,50.85 4.9,56.95 6.68,58.72 | 5.89,49.86 4.9,48.87 4.9,42.65 7.11,40.44 S1.1 S1.2 22.25,40.44 23.34,39.34 28.25,39.34 JP2.1 29.08,40.18 29.08,44.68 JP7.1 | 28.27,45.44 JP7.1 | IC1.57 54.36,49.56 50.6,45.8 | C18.+ 51.41,21.44 | 51.41,21.44 52.27,20.57 58.75,20.57 59.54,21.36 59.54,22.5 C13.+ | 51.41,21.44 48.31,18.34 IC3.3 45.5,18.96 45.26,19.2 | v56.62,37.67 56.05,37.67 55.36,36.98 | JP4.2 89.36,72.47 90.25,71.58 94.82,71.58 96.55,69.85 96.55,62.66 94.92,61.04 94.64,61.04 | 94.64,61.04 C16.- | IC4.16 95.68,59.99 94.64,61.04 | v28.27,53.29 28.27,53.26 29.08,52.45 29.08,46.25 JP7.1 | v19.43,9.47 19.43,13.8 X1.4
  Bottom 0.305: v47.37,33.76 47.4,33.76 51.28,29.87 | v56.62,37.67 57.58,36.7 65.02,36.7 | C16.- 93.17,62.74 92.25,63.65 89.36,63.65 88.24,62.53 88.24,60.3 84.76,56.82 79.32,56.82 77.22,54.71 73.25,54.71 71.14,52.6 71.14,47.04 v71.12,47.02 71.12,42.8 65.02,36.7 | 51.28,29.87 51.41,29.74 C18.+ | 51.28,29.87 58.19,29.87 65.02,36.7 | v40.31,64.19 27.03,64.19 23.6,67.61 15.39,67.61 S4.2 | v35.59,53.29 v28.27,53.29 | v19.43,9.47 19.43,3.38 18.14,2.08 5.44,2.08 1.25,6.27 1.25,7.19 1.29,32.77 S1.1
VDD  (via drill 0.6)
  Top 0.305: JP5.2 72.87,75.51 74.04,76.68 78.11,76.68 v78.13,76.71 | 67.11,30.33 C12.+ 64.54,26.59 64.54,20.22 61.39,17.07 IC2.3 61.39,16.79 59.69,18.49 54.46,18.49 53.37,17.4 53.37,16.18 IC3.1 | 67.11,30.33 68.12,31.34 75.82,31.34 79.76,35.28 79.76,62.23 81.99,64.47 89.1,64.47 90.91,66.27 90.91,69.34 R12.1 | C11.+ 59.49,30.56 60.45,31.52 65.91,31.52 67.11,30.33
  Bottom 0.305: v78.13,76.71 92.91,76.71 94.77,74.85 94.77,70.79 93.37,69.39 90.91,69.39 R12.1
VREF+  (via drill 0.6)
  Top 0.305: IC1.16 43.98,43.29 43.18,42.49 43.18,41.07 38.43,35.99 38.43,34.62 | JP3.3 30.73,21.08 v30.76,21.11 | 38.43,34.62 38.43,34.57 v38.46,34.54 | 38.43,34.62 v38.46,34.59
  Bottom 0.305: v38.46,34.59 38.46,34.47 40.62,32.31 40.62,24.87 36.83,21.08 30.79,21.08 v30.76,21.11
VREF-  (via drill 0.6)
  Top 0.305: IC1.15 43.66,43.79 42.62,42.75 42.62,41.4 35.69,34.47 v35.69,20.17 | JP3.2 15.04,18.54 v15.06,18.52
  Bottom 0.305: v15.06,18.52 34.09,18.52 v35.69,20.17

### Text on the board
tNames: CAN | DISPLAY | ICSP | Kit de Desenvolvimento / para Instrumentacao | PWM | CHAVES | ADC | RS232
bNames: I2C